# EasyEDA Pro project OSC-chaosheng.eprj, board 触发电路
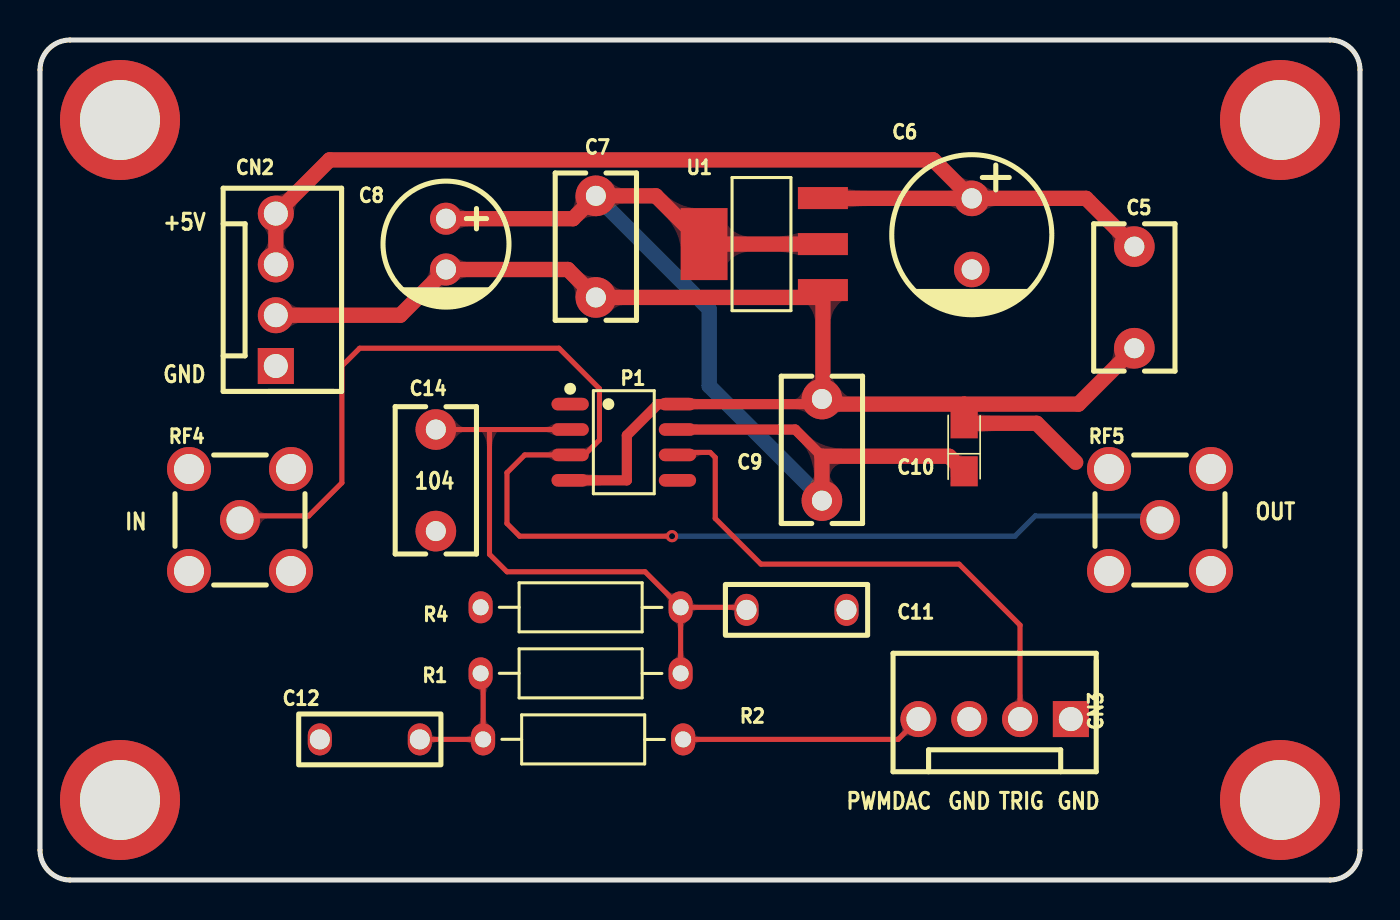
[diagram p17: board, top side]
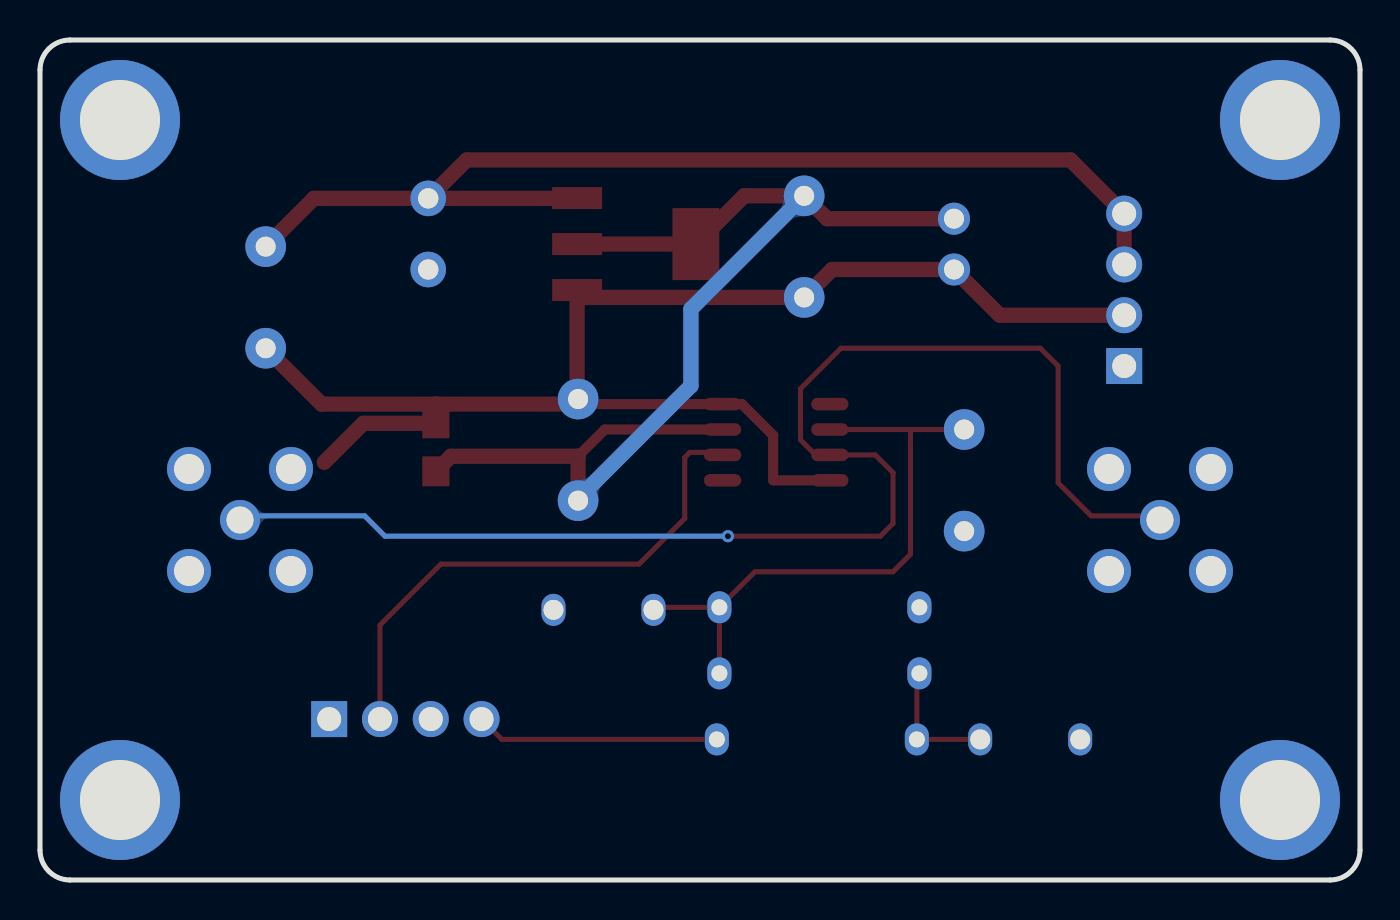
[diagram p18: board, bottom side, seen from below]

Outline 66 x 42 mm; copper layers: Top Layer, Bottom Layer. Coordinates in mm from the lower left corner of the outline.
Outline path: 0,40.5 0,1.5 arc(0.44,0.44) 1.5,0 64.5,0 arc(65.56,0.44) 66,1.5 66,40.5 arc(65.56,41.56) 64.5,42 1.5,42 arc(0.44,41.56) 0,40.5
Stack: Top Layer 0.035mm / Dielectric1 1.51mm FR4 er 4.5 / Bottom Layer 0.035mm

## Design rules (mm)
template: 自定义配置1
spacing copperThickness1oz (default): track to track 0.203, other pairs 0.203 to 0.203
spacing copperThickness2oz: track to track 0.203, other pairs 0.152 to 0.3
track width copperThickness1oz (default): min 0.254, default 0.254, max 2.54
track width copperThickness2oz: min 0.203, default 0.254, max 2.54
track width 5VandGND: min 0.254, default 0.762, max 2.54
differential pair differentialPair (default): width min 0.127, default 0.254, max 2.54; gap min 0.152, default 0.152
via viaSize (default): diameter min 0.5, default 0.61, max 10; hole min 0.3, default 0.305, max 6.299
net GND uses 5VandGND
net +3V3 uses 5VandGND
net +5V uses 5VandGND

## Placement (name value [footprint] x y rotation side)
C5  104  [CAP-TH_L7.2-W4.0-P5.00-D0.5]  54.72 29.13 270 top
C6  16V/470uF  [CAP-TH_BD8.0-P3.50-D0.6-FD]  46.59 32.3 270 top
C7  104  [CAP-TH_L7.2-W4.0-P5.00-D0.5]  27.79 31.67 270 top
C8  16V/100uF  [CAP-TH_BD6.3-P2.50-D1.0-FD]  20.3 31.8 270 top
C9  104  [CAP-TH_L7.2-W4.0-P5.00-D0.5]  39.1 21.51 90 top
C10  16V/2.2uF  [CASE-A_3216]  46.21 21.64 90 top
C11  1UF  [280*100mil]  37.83 13.51 0 top
C12  1UF  [280*100mil]  16.49 7.03 180 top
C14  104  [CAP-TH_L7.2-W4.0-P5.00-D0.5]  19.79 19.98 270 top
CN2  电源  [CONN-TH_4P-P2.54_A2510S-4P]  11.79 29.51 90 top
CN3  TRIG  [CONN-TH_4P-P2.54_A2510S-4P]  47.73 8.05 180 top
NOREF  -  [Pad_e27]  62 4 0 top
NOREF#2  -  [Pad_e26]  4 4 0 top
NOREF#3  -  [Pad_e25]  62 38 0 top
NOREF#4  -  [Pad_e24]  4 38 0 top
P1  TLV3501AIDR  [SOP-8_L4.9-W3.9-P1.27-LS6.0-BL]  29.19 21.89 270 top
R1  10K  [240*80mil]  27.03 10.33 180 top
R2  10K  [240*80mil]  27.16 7.03 0 top
R4  100K  [240*80mil]  27.03 13.63 0 top
RF4  BWSMA-KE-Z001  [SMA-TH_BWSMA-KE-Z001]  10 18 0 top
RF5  BWSMA-KE-Z001  [SMA-TH_BWSMA-KE-Z001]  56 18 0 top
U1  AMS1117-3.3  [SOT-223-3_L6.4-W3.5-P2.30-LS7.0-BR]  36.18 31.8 0 top

## Footprints (pads in the part's own frame, mm; a bottom-side part is the same pattern mirrored in y, then rotated)
240*80mil
  oval 1.2x1.6 hole 0.8: 1(-5,0) 2(5,0)
280*100mil
  oval 1.2x1.6 hole 1x0.8: 1(-2.5,0) 2(2.5,0)
CAP-TH_BD6.3-P2.50-D1.0-FD
  round 1.6 hole 1: 1(-1.27,0) 2(1.27,0)
CAP-TH_BD8.0-P3.50-D0.6-FD
  round 1.778 hole 1.016: 1(-1.778,0) 2(1.778,0)
CAP-TH_L7.2-W4.0-P5.00-D0.5
  round 2.032 hole 1.001: 1(-2.54,0) 2(2.54,0)
CASE-A_3216
  rect 1.5x1.359 smd: 1(-1.2,0) 2(1.2,0)
CONN-TH_4P-P2.54_A2510S-4P
  rect 1.8x1.8 hole 1.2: 1(-3.81,0)
  round 1.8 hole 1.2: 2(-1.27,0) 3(1.27,0) 4(3.81,0)
Pad_e24
  round 6 hole 4: 1(0,0)
Pad_e25
  round 6 hole 4: 1(0,0)
Pad_e26
  round 6 hole 4: 1(0,0)
Pad_e27
  round 6 hole 4: 1(0,0)
SMA-TH_BWSMA-KE-Z001
  round 2.2 hole 1.5: 1(-2.55,-2.55) 2(-2.55,2.55) 3(2.55,2.55) 4(2.55,-2.55)
  round 2 hole 1.35: 5(0,0)
SOP-8_L4.9-W3.9-P1.27-LS6.0-BL
  oval 0.63x1.865 smd: 1(-1.905,-2.683) 2(-0.635,-2.683) 3(0.635,-2.683) 4(1.905,-2.683) 5(1.905,2.683) 6(0.635,2.683) 7(-0.635,2.683) 8(-1.905,2.683)
SOT-223-3_L6.4-W3.5-P2.30-LS7.0-BR
  rect 2.499x1.1 smd: 1(2.97,-2.299) 2(2.97,0) 3(2.97,2.301)
  rect 2.34x3.599 smd: 4(-2.97,0)

## Nets
As in the schematic, except:
GND: C5.2 C6.2 C7.2 C8.2 C9.2 C10.2 C11.2 C12.2 C14.2 CN2.1 CN2.2 CN3.1 CN3.3 NOREF.1 NOREF#2.1 NOREF#3.1 NOREF#4.1 P1.4 P1.8 R4.1 RF4.1 RF4.2 RF4.3 RF4.4 RF5.1 RF5.2 RF5.3 RF5.4 U1.1

Pads without a net: P1 1 5

## Via types
v1: diameter 0.61, hole 0.305, Top Layer to Bottom Layer, 1 via

## Routing (per net, layer and track width the routed paths; a pad name or vN(x,y) marks a point on that pad's centre or on a via; arc(x,y) is an arc through that point)
+3V3: length 57.2
  Top Layer w0.508: 39.1,21.19 37.76,22.52 P1.7
  Top Layer w0.762: U1.2 U1.4 30.79,34.21 C7.1 26.65,33.06 C8.1 ; 39.1,19.22 39.1,21.19 45.46,21.19 C10.1
  Bottom Layer w0.762: 39.1,19.22 38.94,19.22 33.46,24.7 33.46,28.55 C7.1
+5V: length 55.8
  Top Layer w0.762: CN2.3 CN2.4 14.48,36.01 44.66,36.01 C6.1 ; C5.1 52.3,34.08 C6.1 ; C6.1 39.16,34.08 U1.3
GND: length 74.2
  Top Layer w0.508: P1.4 29.34,19.98 29.34,22.23 30.9,23.79 P1.8 39.1,23.79
  Top Layer w0.762: 39.14,29.13 39.14,24.35 39.1,24.3 39.1,23.79 46.21,23.79 ; 39.14,29.13 C7.2 26.4,30.53 C8.2 18.01,28.24 CN2.2 ; 39.14,29.13 U1.1 ; 46.21,23.79 C10.2 49.83,22.83 51.79,20.88 ; 46.21,23.79 51.92,23.79 C5.2
CH1: length 69.5
  Top Layer w0.254: v1(31.6,17.19) 23.98,17.19 23.35,17.83 23.35,20.36 24.24,21.25 P1.3 27.22,21.25 27.97,22.01 27.97,24.57 25.95,26.59 15.98,26.59 15.09,25.7 15.09,19.86 13.44,18.21 10.01,18.21
  Bottom Layer w0.254: RF5.5 55.79,18.21 49.76,18.21 48.75,17.19 v1(31.6,17.19)
DAC1: length 30.3
  Top Layer w0.254: R4.2 35.2,13.63 C11.1 ; R4.2 30.25,15.41 23.35,15.41 22.47,16.28 22.47,22.52 ; R4.2 R1.1 ; P1.2 22.47,22.52 ; 22.47,22.52 C14.1
PWMDAC1: length 12.2
  Top Layer w0.254: R2.2 42.91,7.03 CN3.4
TRIG-A: length 27.2
  Top Layer w0.254: CN3.2 49,12.75 45.95,15.79 36.05,15.79 33.76,18.08 33.76,21.13 33.51,21.38 32,21.38 P1.6
$1N704: length 6.5
  Top Layer w0.254: C12.1 R2.1 22.16,10.2 R1.2

## Copper pours and planes (outline as drawn; the poured copper is in the pictures)
GND on Top Layer: -4.85,46.91 69.07,46.91 69.07,-9.48 -4.85,-9.48
GND on Bottom Layer: -7,47.16 80.88,47.16 80.88,-15.83 -7,-15.83

Small or netless copper shapes (teardrops, artwork), in the pictures only: 53 on Top Layer, 4 on Bottom Layer

## Text on the board
Top Silkscreen Layer: 104 | IN | +5V | GND | PWMDAC | TRIG | OUT
